# Altium project HYDRA_V4_ACTUATOR.PrjPcb
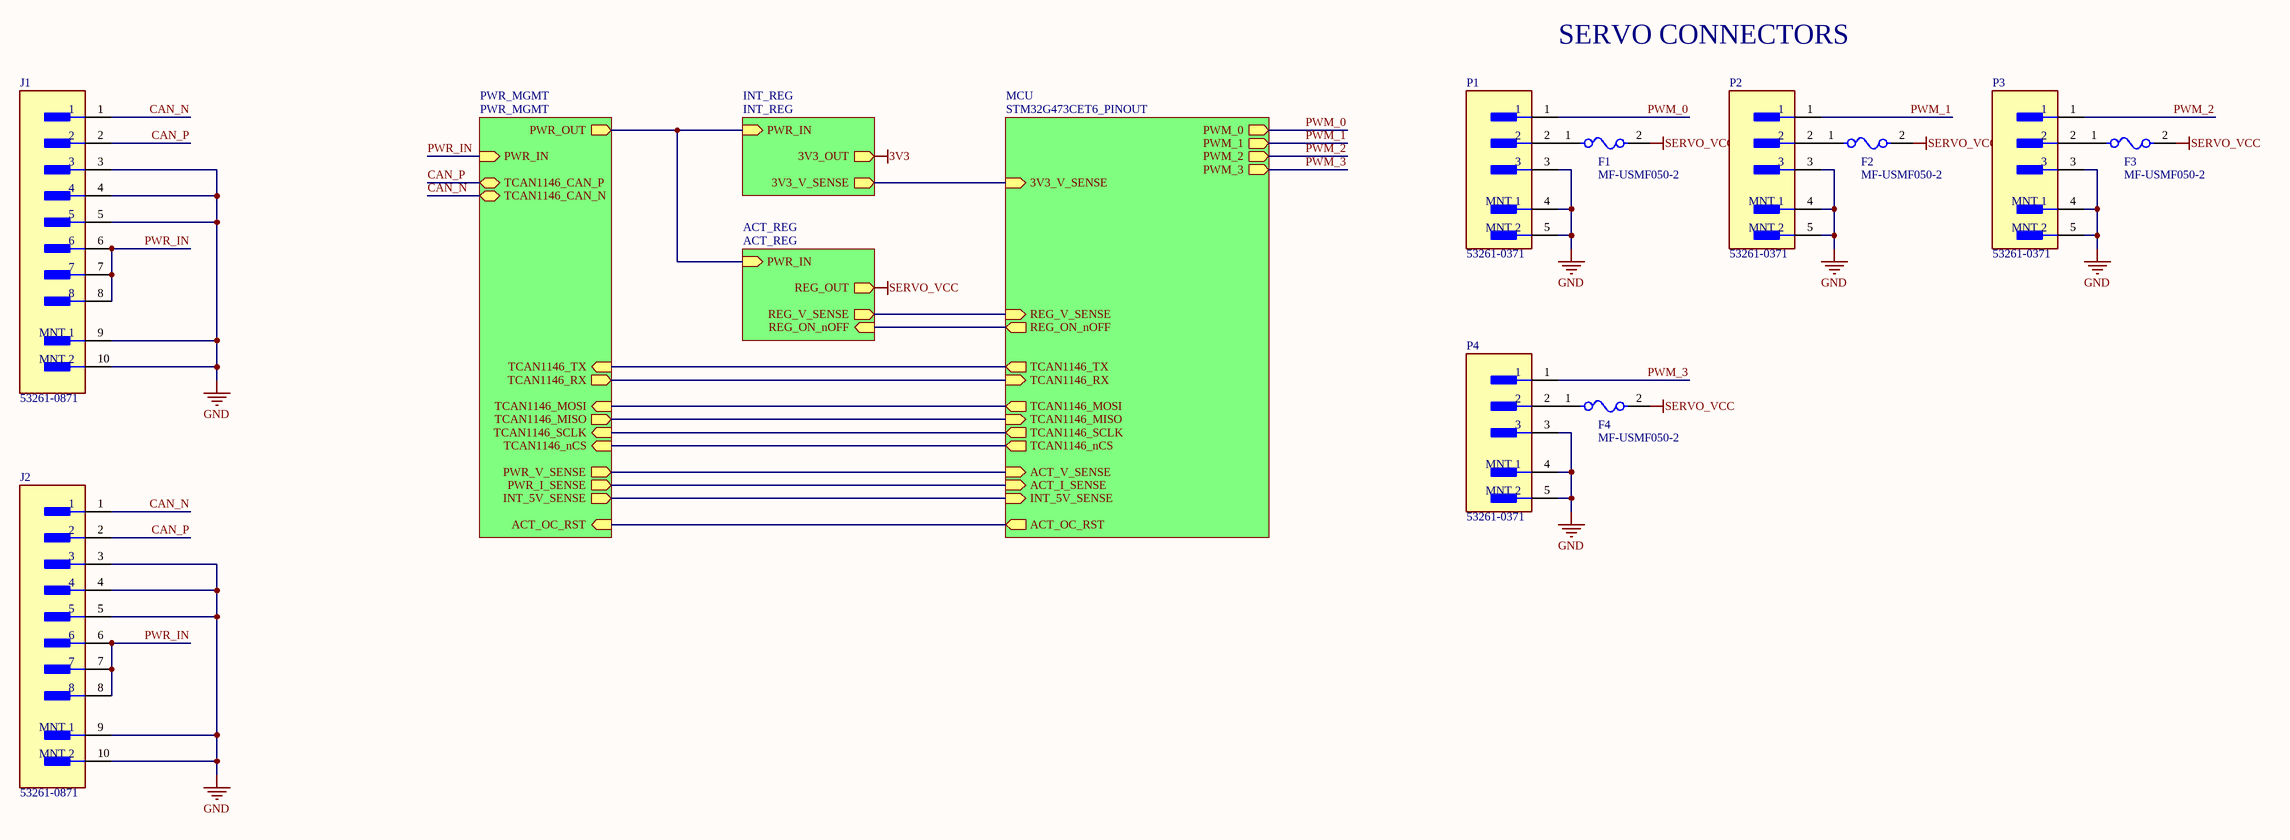
[diagram p0: HYDRA_V4_ACTUATOR.SchDoc]
5 sheets, 99 parts. Net scope: hierarchical (ports join the sheet entries above them; power ports are global).
Board file: HYDRA_V4_ACTUATOR.PcbDoc
Sheets:
  HYDRA_V4_ACTUATOR.SchDoc
    PWR_MGMT = PWR_MGMT.SchDoc
    INT_REG = INT_REG.SchDoc
    MCU = STM32G473CET6_PINOUT.SchDoc
    ACT_REG = ACT_REG.SchDoc

## Sheet HYDRA_V4_ACTUATOR.SchDoc
size C; SheetNumber: 1; SheetTotal: 5

### Parts
F1  MF-USMF050-2  [FP-MF-USMF-MFG]
F2  MF-USMF050-2  [FP-MF-USMF-MFG]
F3  MF-USMF050-2  [FP-MF-USMF-MFG]
F4  MF-USMF050-2  [FP-MF-USMF-MFG]
J1  53261-0871  [FP-532610871-MFG]
J2  53261-0871  [FP-532610871-MFG]
P1  53261-0371  [FP-53261-0371-MFG]
P2  53261-0371  [FP-53261-0371-MFG]
P3  53261-0371  [FP-53261-0371-MFG]
P4  53261-0371  [FP-53261-0371-MFG]

### Sub-sheets
ACT_REG = ACT_REG: PWR_IN (in), REG_OUT (out), REG_V_SENSE (out), REG_ON_nOFF (in)
INT_REG = INT_REG: PWR_IN (in), 3V3_OUT (out), 3V3_V_SENSE (out)
MCU = STM32G473CET6_PINOUT: 3V3_V_SENSE (in), REG_V_SENSE (in), ACT_OC_RST (out), INT_5V_SENSE (in), ACT_I_SENSE (in), ACT_V_SENSE (in), TCAN1146_nCS (out), TCAN1146_SCLK (out), TCAN1146_MISO (in), TCAN1146_MOSI (out), TCAN1146_TX (out), TCAN1146_RX (in), PWM_0 (out), PWM_1 (out), PWM_3 (out), PWM_2 (out), REG_ON_nOFF (out)
PWR_MGMT = PWR_MGMT: PWR_IN (in), PWR_OUT (out), TCAN1146_TX (in), TCAN1146_RX (out), TCAN1146_MOSI (in), TCAN1146_MISO (out), TCAN1146_SCLK (in), TCAN1146_nCS (in), PWR_I_SENSE (out), PWR_V_SENSE (out), INT_5V_SENSE (out), ACT_OC_RST (in), TCAN1146_CAN_P (bidir), TCAN1146_CAN_N (bidir)

### Nets
GND: J1.3 J1.4 J1.5 J1.9(MNT_1) J1.10(MNT_2) J2.3 J2.4 J2.5 J2.9(MNT_1) J2.10(MNT_2) P1.3 P1.4(MNT_1) P1.5(MNT_2) P2.3 P2.4(MNT_1) P2.5(MNT_2) P3.3 P3.4(MNT_1) P3.5(MNT_2) P4.3 P4.4(MNT_1) P4.5(MNT_2)
SERVO_VCC: F1.2 F2.2 F3.2 F4.2 ; sheet ACT_REG/REG_OUT  [project net REG_OUT]
3V3_V_SENSE: sheet INT_REG/3V3_V_SENSE, sheet MCU/3V3_V_SENSE
5V_ON_nOFF: sheet MCU/REG_ON_nOFF, sheet ACT_REG/REG_ON_nOFF
ACT_I_SENSE: sheet PWR_MGMT/PWR_I_SENSE, sheet MCU/ACT_I_SENSE
ACT_OC_RST: sheet PWR_MGMT/ACT_OC_RST, sheet MCU/ACT_OC_RST
ACT_V_SENSE: sheet PWR_MGMT/PWR_V_SENSE, sheet MCU/ACT_V_SENSE
CAN_N: J1.1 J2.1 ; sheet PWR_MGMT/TCAN1146_CAN_N  [project net CAN0_N]
CAN_P: J1.2 J2.2 ; sheet PWR_MGMT/TCAN1146_CAN_P  [project net CAN0_P]
INT_5V_SENSE: sheet PWR_MGMT/INT_5V_SENSE, sheet MCU/INT_5V_SENSE
PWM_0: P1.1 ; sheet MCU/PWM_0
PWM_1: P2.1 ; sheet MCU/PWM_1
PWM_2: P3.1 ; sheet MCU/PWM_2
PWM_3: P4.1 ; sheet MCU/PWM_3
PWR_IN: J1.6 J1.7 J1.8 J2.6 J2.7 J2.8 ; sheet PWR_MGMT/PWR_IN
REG_V_SENSE: sheet MCU/REG_V_SENSE, sheet ACT_REG/REG_V_SENSE
SPI2_MISO: sheet PWR_MGMT/TCAN1146_MISO, sheet MCU/TCAN1146_MISO
SPI2_MOSI: sheet PWR_MGMT/TCAN1146_MOSI, sheet MCU/TCAN1146_MOSI
SPI2_nCS: sheet PWR_MGMT/TCAN1146_nCS, sheet MCU/TCAN1146_nCS
SPI2_SCLK: sheet PWR_MGMT/TCAN1146_SCLK, sheet MCU/TCAN1146_SCLK
TCAN1146_RX: sheet PWR_MGMT/TCAN1146_RX, sheet MCU/TCAN1146_RX
TCAN1146_TX: sheet PWR_MGMT/TCAN1146_TX, sheet MCU/TCAN1146_TX
NetC17_2: sheet PWR_MGMT/PWR_OUT, sheet INT_REG/PWR_IN, sheet ACT_REG/PWR_IN
NetF1_1: F1.1 P1.2
NetF2_1: F2.1 P2.2
NetF3_1: F3.1 P3.2
NetF4_1: F4.1 P4.2

### Notes on the sheet
- SERVO CONNECTORS

### Library data of the parts
F1-F4 = CMP-07400-000020-1: PTC RESET FUSE 13.2V 500MA 1210; Manufacturer: Bourns Inc.; Value: 0.18-0.9Ω; Trip Current: 1A; Current Rating: 40A; Trip Time: 0.1s; Automotive Grade: Grade 3; Hold Current: 0.5A; Package: MF-USMF; Voltage Rating: 13.2V; Device Class L2: PTC Resettable Fuses; Temperature: -40°C to +85°C; Device Class L1: Circuit Protection; Device Class L3: unset; Height: 0.85mm; ComponentLink2Description: Datasheet; Temperature Range Low: -40°C; Ambient Temperature Range Low: -40°C; Category: Fuse; Lead Free: Yes; Temperature Range High: +85°C; Mouser Description: Resettable Fuses - PPTC 0.50A 13.2V 0.18ohm Hold .5A Trip 1A; Manufacturer Part Number: MF-USMF050-2; Resistance: 0.18-0.9Ω; RoHS: TRUE; Ipc Land Pattern Name: CAPC321258X70; Ambient Temperature Range High: +85°C; Automotive: Yes; Digikey Description: PTC RESET FUSE 13.2V 500MA 1210; Octopart: https://octopart.com/mf-usmf050-2-bourns-97645; ComponentLink2URL: https://www.bourns.com/docs/Product-Datasheets/mfusmf.pdf
J1 J2 = CMP-002-00053-1: Board Connector, 8 Contact(s), 1 Row(s), Male, Right Angle, 0.049 inch Pitch, Surface Mount Terminal, Locking, Natural Insulator, Receptacle; RoHS Compliant: Yes; Max Operating Temperature: 85°C; Min Operating Temperature: -40°C; Connector Type: BOARD CONNECTOR; Mounting Technology: Board
P1-P4 = CMP-04776-000071-1: CONN HEADER SMD R/A 3POS 1.25MM; Manufacturer: Molex; Number Of Contacts: 3; Conn Orientation: Right Angle; Current Rating: 1A; Voltage Rating: 125V; Conn Gender: Male; Category: Conn; Automotive: No; Footprint Url: https://www.molex.com/pdm_docs/sd/532610371_sd.pdf; Height: 3.6mm; Number Of Rows: 1; Temperature Range Low: -40°C; Package: 0; Octopart: https://octopart.com/53261-0371-molex-655314; ComponentLink2Description: Datasheet; Lead Free: Yes; Ambient Temperature Range Low: -40°C; Device Class L3: unset; Mouser Description: 1.25mm (.049") Pitch PicoBlade Header, Surface Mount, Right Angle, Lead-free, 3 Circuits; Digikey Description: CONN HEADER SMD R/A 3POS 1.25MM; Device Class L2: Headers and Wire Housings; Contact Material: Tin,Nickel; Manufacturer Part Number: 53261-0371; Ambient Temperature Range High: +105°C; ComponentLink2URL: https://www.molex.com/webdocs/datasheets/pdf/en-us/0532610371_PCB_HEADERS.pdf; Pitch: 1.25mm; Temperature: -40°C to +105°C; RoHS: TRUE; Device Class L1: Connectors; Temperature Range High: +105°C

## Sheet PWR_MGMT.SchDoc
size C; SheetNumber: 4; SheetTotal: 5
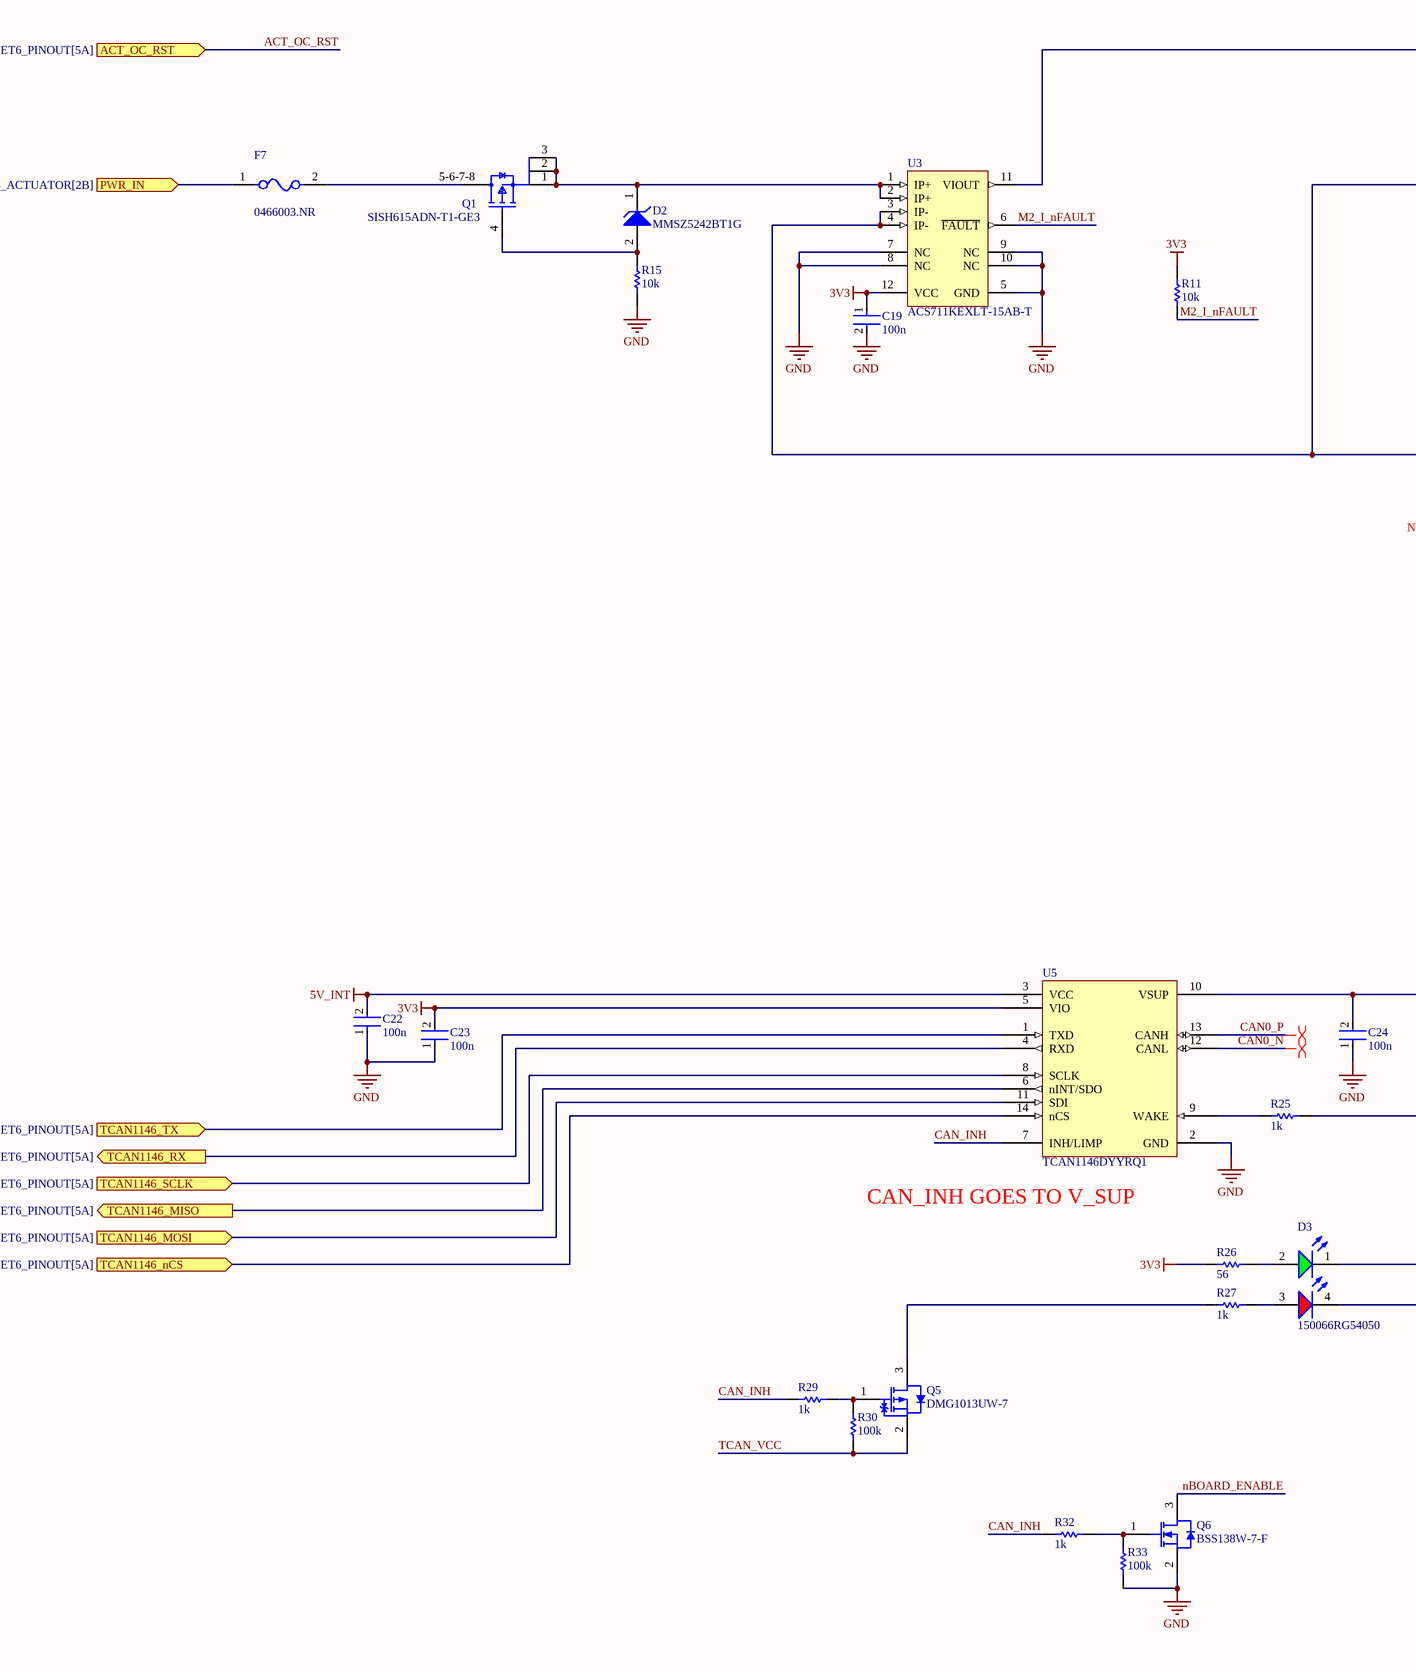
[diagram p1: PWR_MGMT.SchDoc, left]
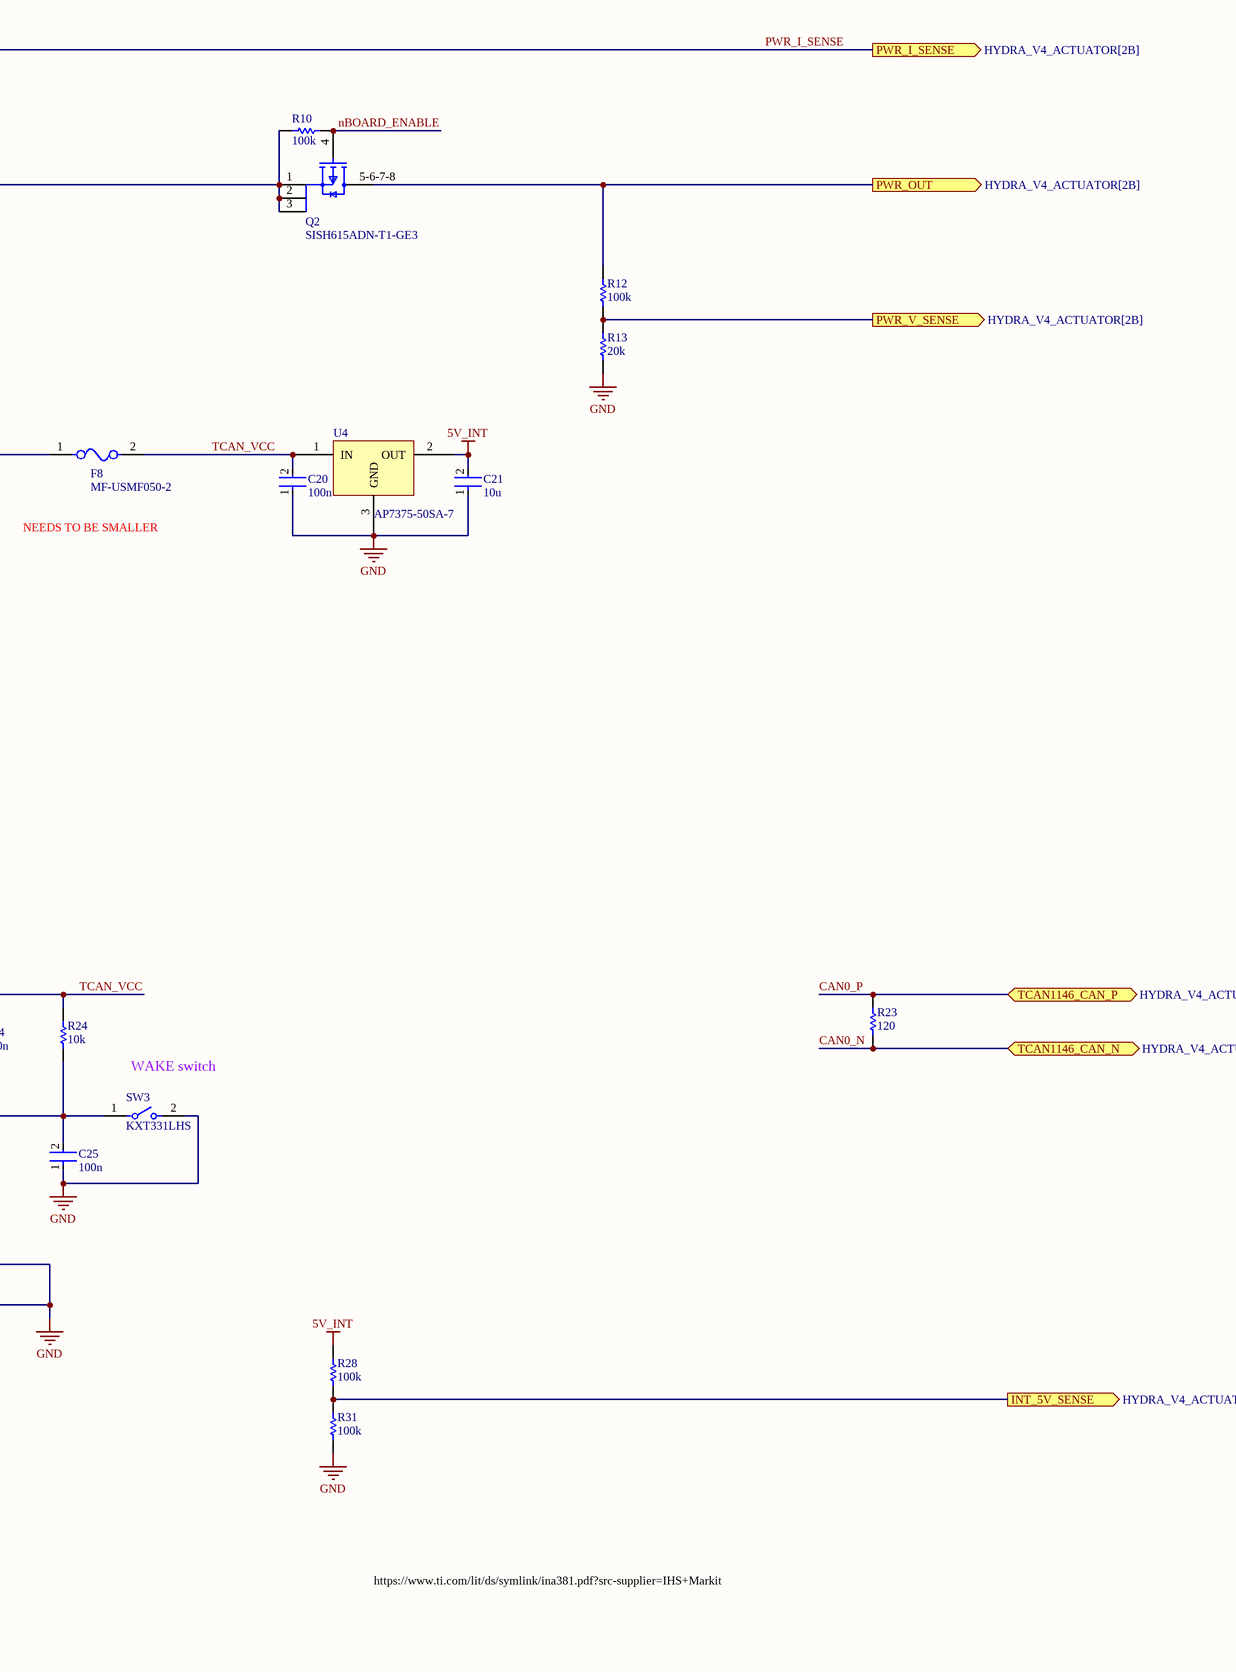
[diagram p2: PWR_MGMT.SchDoc, right]

### Parts
C19  100n  [FP-0402-L_1_0_0_05-W_0_5-IPC_A]
C20  100n  [FP-0402-L_1_0_0_05-W_0_5-IPC_A]
C21  10u  [FP-0402-L_1_0_0_05-W_0_5-IPC_A]
C22  100n  [FP-0402-L_1_0_0_05-W_0_5-IPC_A]
C23  100n  [FP-0402-L_1_0_0_05-W_0_5-IPC_A]
C24  100n  [FP-0402-L_1_0_0_05-W_0_5-IPC_A]
C25  100n  [FP-0402-L_1_0_0_05-W_0_5-IPC_A]
D2  MMSZ5242BT1G  [ONSC-SOD-123-2-425-04_V]
D3  150066RG54050  [WL-SBCD_0606]
F7  0466003.NR  [FP-0466-MFG]
F8  MF-USMF050-2  [FP-MF-USMF-MFG]
Q1  SISH615ADN-T1-GE3  [SISH615ADN-T1-GE3-Footprint-1]
Q2  SISH615ADN-T1-GE3  [SISH615ADN-T1-GE3-Footprint-1]
Q5  DMG1013UW-7  [DIOD-SOT323-3_V]
Q6  BSS138W-7-F  [DIOD-SOT323-3_V]
R10  100k  [R0603B]
R11  10k  [R0603B]
R12  100k  [R0603B]
R13  20k  [R0603B]
R15  10k  [R0603B]
R23  120  [R0603B]
R24  10k  [R0603B]
R25  1k  [R0603B]
R26  56  [R0603B]
R27  1k  [R0603B]
R28  100k  [R0603B]
R29  1k  [R0603B]
R30  100k  [R0603B]
R31  100k  [R0603B]
R32  1k  [R0603B]
R33  100k  [R0603B]
SW3  KXT331LHS  [FP-KXT331LHS-MFG]
U3  ACS711KEXLT-15AB-T  [ALEG-EX-12_V]
U4  AP7375-50SA-7  [AP7375-50SA-7-Footprint-1]
U5  TCAN1146DYYRQ1  [TCAN1146DYYRQ1-Footprint-1]

### Ports
ACT_OC_RST (in, see HYDRA_V4_ACTUATOR[2B], STM32G473CET6_PINOUT[5A]), INT_5V_SENSE (out, see HYDRA_V4_ACTUATOR[2B], STM32G473CET6_PINOUT[5B]), PWR_I_SENSE (out, see HYDRA_V4_ACTUATOR[2B]), PWR_IN (in, see HYDRA_V4_ACTUATOR[2B]), PWR_OUT (out, see HYDRA_V4_ACTUATOR[2B]), PWR_V_SENSE (out, see HYDRA_V4_ACTUATOR[2B]), TCAN1146_CAN_N (bidir, see HYDRA_V4_ACTUATOR[2B]), TCAN1146_CAN_P (bidir, see HYDRA_V4_ACTUATOR[2B]), TCAN1146_MISO (out, see HYDRA_V4_ACTUATOR[2B], STM32G473CET6_PINOUT[5A]), TCAN1146_MOSI (in, see HYDRA_V4_ACTUATOR[2B], STM32G473CET6_PINOUT[5A]), TCAN1146_nCS (in, see HYDRA_V4_ACTUATOR[2B], STM32G473CET6_PINOUT[5A]), TCAN1146_RX (out, see HYDRA_V4_ACTUATOR[2B], STM32G473CET6_PINOUT[5A]), TCAN1146_SCLK (in, see HYDRA_V4_ACTUATOR[2B], STM32G473CET6_PINOUT[5A]), TCAN1146_TX (in, see HYDRA_V4_ACTUATOR[2B], STM32G473CET6_PINOUT[5A])

### Nets
3V3: C19.1 C23.2 R11.2 R26.2 U3.12(VCC) U5.5(VIO)
5V_INT: C21.2 C22.2 R28.2 U4.2(OUT) U5.3(VCC)
GND: C19.2 C20.1 C21.1 C22.1 C23.1 C24.1 C25.1 D3.1(K) D3.4(K) Q6.2(S) R13.1 R15.1 R31.1 R33.1 SW3.2 U3.5(GND) U3.7(NC) U3.8(NC) U3.9(NC) U3.10(NC) U4.3(GND) U5.2(GND)
ACT_V_SENSE: R12.1 R13.2 ; port PWR_V_SENSE
CAN0_N: R23.1 U5.12(CANL) ; port TCAN1146_CAN_N
CAN0_P: R23.2 U5.13(CANH) ; port TCAN1146_CAN_P
CAN_INH: R29.2 R32.2 U5.7(INH/LIMP)
INT_5V_SENSE: R28.1 R31.2 ; port INT_5V_SENSE
M2_I_nFAULT: R11.1 U3.6(~{FAULT})
nBOARD_ENABLE: Q2.4(G) Q6.3(D) R10.2
PWR_I_SENSE: U3.11(VIOUT) ; port PWR_I_SENSE  [project net ACT_I_SENSE]
PWR_IN: F7.1 ; port PWR_IN
SPI2_MISO: U5.6(nINT/SDO) ; port TCAN1146_MISO
SPI2_MOSI: U5.11(SDI) ; port TCAN1146_MOSI
SPI2_nCS: U5.14(nCS) ; port TCAN1146_nCS
SPI2_SCLK: U5.8(SCLK) ; port TCAN1146_SCLK
TCAN1146_RX: U5.4(RXD) ; port TCAN1146_RX
TCAN1146_TX: U5.1(TXD) ; port TCAN1146_TX
TCAN_VCC: C20.2 C24.2 F8.2 Q5.2(S) R24.2 R30.2 U4.1(IN) U5.10(VSUP)
NetC17_2: Q2.5-6-7-8(D) R12.2 ; port PWR_OUT
NetC25_2: C25.2 R24.1 R25.1 SW3.1
NetD2_1: D2.1(K) Q1.1(S) Q1.2(S) Q1.3(S) U3.1(IP+) U3.2(IP+)
NetD2_2: D2.2(A) Q1.4(G) R15.2
NetD3_2: D3.2(A) R26.1
NetD3_3: D3.3(A) R27.1
NetF7_2: F7.2 Q1.5-6-7-8(D)
NetF8_1: F8.1 Q2.1(S) Q2.2(S) Q2.3(S) R10.1 U3.3(IP-) U3.4(IP-)
NetQ5_1: Q5.1(G) R29.1 R30.1
NetQ5_3: Q5.3(D) R27.2
NetQ6_1: Q6.1(G) R32.1 R33.2
NetR25_2: R25.2 U5.9(WAKE)

### Layout directives
differential pair; differential pair class 120DIFF: CAN0_N, CAN0_P

### Notes on the sheet
- NEEDS TO BE SMALLER
- (near SW3) WAKE switch
- (near U5) CAN_INH GOES TO V_SUP
- https://www.ti.com/lit/ds/symlink/ina381.pdf?src-supplier=IHS+Markit

### Library data of the parts
C19-C25 = CMP-001-00058-1: LARGE PADS, 0402 CAP, CHANGE COMMENT TO MATCH REAL P/N; Capacitor Type: Ceramic; Min Operating Temperature: -55°C; Mounting Technology: Surface Mount; Pins: 2; Case/Package: 0402; RoHS Compliant: Yes; Max Operating Temperature: 85°C
D2 = CMP-1060-00565-1: Zener Voltage Regulator, 500 mW, 2-Pin SOD-123, Pb-Free, Tape and Reel; Manufacturer: On Semiconductor; P Max (W): 0.5; VZ Typ (V): 12; PartNumber: MMSZ5242BT1G; PackageReference: SOD-123-2-425-04; ComponentLink3URL: http://www.onsemi.com/pub_link/Collateral/425-04.PDF; Mounting Technology: Surface Mount; ComponentLink2Description: Datasheet; ComponentLink1URL: http://www.onsemi.com/; ComponentLink3Description: Package Specification; PackageDescription: 2-Pin SOD, Body 1.6 x 2.69 mm; PackageVersion: Rev. G, 10/2009; ComponentLink1Description: Manufacturer URL; RoHS: Pb-Free; ComponentLink2URL: http://www.onsemi.com/pub_link/Collateral/MMSZ5221BT1-D.PDF; Packing: Tape and Reel; DatasheetVersion: Rev. 12
D3 = CMP-004-00040-2: Led, Red/Grn, 180Mcd/230Mcd, 624Nm/525Nm Rohs Compliant: Yes; Source: rgled.SchLib; Component Type: Standard; Design Item ID: CMP-004-00034-2; Pins: 4
F7 = CMP-08605-000054-1: FUSE BOARD MNT 3A 32VAC/VDC 1206; Manufacturer: Littelfuse; Fuse Interrupt Ac Current: 50A; Fuse Voltage Drop: 75.99mV; Max Fuse Ac Voltage: 32V; Fuse I2T: 0.576A2Sec; Resistance: 0.019Ω; Fuse Blow Speed: Fast; Value: 0.019Ω; ComponentLink2Description: Datasheet; Fuse Current: 3A; RoHS: TRUE; Mouser Description: Surface Mount Fuses 32V 3A VFA Slimline; Height: 0.66mm; Octopart: https://octopart.com/0466003.nr-littelfuse-565175; Package: 0466; Fuse Interrupt Dc Current: 50A; Manufacturer Part Number: 0466003.NR; Temperature Range Low: -55°C; ComponentLink2URL: https://www.littelfuse.com/~/media/electronics/datasheets/fuses/littelfuse_fuse_466_datasheet.pdf.pdf; Digikey Description: FUSE BOARD MNT 3A 32VAC/VDC 1206; Voltage Rating: 32V; Category: Fuse; Lead Free: Yes; Device Class L2: Fuses; Automotive: No; Max Fuse Dc Voltage: 32V; Temperature Range High: +90°C; Device Class L3: unset; Device Class L1: Circuit Protection; Temperature: -55°C to +90°C
F8 = CMP-07400-000020-1: as F1 on sheet HYDRA_V4_ACTUATOR; Package: MF-USMF; Voltage Rating: 13.2V; Device Class L2: PTC Resettable Fuses; Temperature: -40°C to +85°C; Device Class L1: Circuit Protection; Device Class L3: unset; Height: 0.85mm; ComponentLink2Description: Datasheet; Temperature Range Low: -40°C; Ambient Temperature Range Low: -40°C; Category: Fuse; Lead Free: Yes; Temperature Range High: +85°C; Mouser Description: Resettable Fuses - PPTC 0.50A 13.2V 0.18ohm Hold .5A Trip 1A; Manufacturer Part Number: MF-USMF050-2; Resistance: 0.18-0.9Ω; RoHS: TRUE; Ipc Land Pattern Name: CAPC321258X70; Ambient Temperature Range High: +85°C; Automotive: Yes; Digikey Description: PTC RESET FUSE 13.2V 500MA 1210; Octopart: https://octopart.com/mf-usmf050-2-bourns-97645; ComponentLink2URL: https://www.bourns.com/docs/Product-Datasheets/mfusmf.pdf
Q1 Q2 = CMP-013-00018-2: Trans MOSFET P-CH 20V 22.1A 8-Pin PowerPAK 1212 EP T/R; Source: SISH615ADN-T1-GE3.SchLib; Design Item ID: CMP-013-00036-4; Component Type: Standard; Pins: 5
Q5 = CMP-2000-06170-1: P-Channel Enhancement Mode MOSFET, 310 mW, 20 V, -55 to 150 degC, 3-Pin SOT-323, RoHS, Tape and Reel; Manufacturer: Diodes Inc; Qg Gate Charge: 0.622nC; Drain-Source On Resistance-Max: 750mO; Rated Power Dissipation: 310mW; Drain-to-Source Voltage [Vdss]: 20V; Package Reference: SOT323; Datasheet Version: Rev. 3-2, 09/2013; Package Description: 3-Pin Small Outline Transistor, Body 2 x 1.25 mm, Pitch 0.65 mm; Mounting Technology: SurfaceMount; Manufacturer URL: http://www.diodes.com/; Datasheet URL: http://www.diodes.com/_files/datasheets/ds31861.pdf; Channel Type: P-Channel
Q6 = CMP-2000-05968-1: N-Channel Enhancement Mode Mosfet, 50 V, 200 mA, -55 to 150 degC, 6-Pin SOT-323, RoHS, Tape and Reel; Typical Turn-Off Delay Time: 20ns; Number of Channels: 1Channel; Type: EnhancementModeFieldEffectTransistor; Brand: DiodesIncorporated; Vds - Drain-Source Breakdown Voltage: 75V; Vgs - Gate-Source Voltage: 20V; Rds On - Drain-Source Resistance: 1.4Ohms; Transistor Type: 1N-Channel; Configuration: Single; Unit Weight: 0.000212oz; Pd - Power Dissipation: 200mW; Id - Continuous Drain Current: 200mA; Forward Transconductance - Min: 0.1S; Manufacturer URL: http://www.diodes.com/; Series: BSS138; Package Description: 3-Pin Small Outline Transistor, Body 2 x 1.25 mm, Pitch 0.65 mm; Mounting Technology: SurfaceMount; Product Category: MOSFET; RoHS: True; Maximum Operating Temperature: +150C; Height: 1mm; Length: 2.2mm; Technology: Si; Width: 1.35mm; Datasheet URL: http://www.diodes.com/_files/datasheets/ds30206.pdf; Manufacturer: DiodesIncorporated; Package / Case: SOT-323-3; Typical Turn-On Delay Time: 20ns; Transistor Polarity: N-Channel; Factory Pack Quantity: 3000; Packaging: Reel; Product: MOSFETSmallSignal; Datasheet Version: Rev. 11-2, 09/2013; Package Reference: SOT323; Minimum Operating Temperature: -55C; Mounting Style: SMD/SMT; Channel Mode: Enhancement
R10-R13 R15 R23-R33 = CMP-009-00002-14: Resistor
SW3 = CMP-10040-000029-1: SWITCH TACTILE SPST-NO 0.02A 15V; Operating Force: 240gf; Switch Travel: 0.13mm; Illumination Type: Non-Illuminated; Throw Configuration: SPST; Number of Ports: 1; Current Rating: 5A; Mechanical Life: 500000Cycles; Switch Function: Off-Mom; Connector Type: USB; Actuator Type: Standard; Gender: Receptacle; Number of Contacts: 24; Contact Plating: Gold; Insulation Color: Black; Min Operating Temperature: -40°C; Packaging: Tape and Reel; Flammability Rating: UL94 V-0; Max Operating Temperature: 85°C; Termination: Solder; Mount: Surface Mount
U3 = CMP-1557-00001-1: Hall Effect Linear Current Sensor with Overcurrent Fault Output for <100 V Isolation Applications, 3 to 5.5 V, -15.5 to 15.5 A IP, -40 to 125 degC, 12-Pin QFN (EX), RoHS, Tape and Reel; VCC Max: 5.5 V; IP Max: 15.5 A; VCC Min: 3 V; IP Min: -15.5 A; -3dB Bandwidth: 0.1 MHz; PackageDescription: 12-Pin Quad Flat No-Lead, Body 3 x 3 mm, Height 0.8 mm; ComponentLink1URL: http://www.allegromicro.com/; Packing: Tape and Reel; ComponentLink2URL: http://www.allegromicro.com/~/media/Files/Datasheets/ACS711-Datasheet.ashx?la=en; DatasheetVersion: Rev. 3; PartNumber: ACS711KEXLT-15AB-T; ComponentLink2Description: Datasheet; ComponentLink3URL: http://www.allegromicro.com/~/media/Files/Datasheets/ACS711-Datasheet.ashx?la=en; RoHS: TRUE; ComponentLink1Description: Manufacturer URL; ComponentLink3Description: Package Specification; Temperature Max: 125 degC; Mounting Technology: Surface Mount; Temperature Min: -40 degC
U4 = CMP-019-00041-1: Ldo Cmos Lowcurr SOT23 T&r 3K
U5 = CMP-318-000000-2: Automotive CAN FD transceiver with watchdog, bus diagnostics and partial networking via sele 14-SOT-23-THIN -40 to 150; Component Type: Standard; Design Item ID: CMP-015-00012-2; Pin Count: 14; Source: TCAN1146DYYRQ1.SchLib

## Sheet INT_REG.SchDoc
size A; SheetNumber: 3; SheetTotal: 5
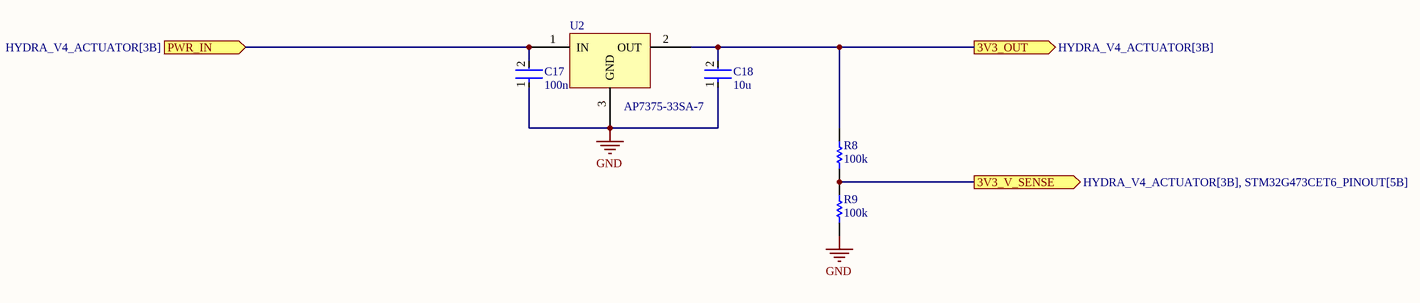
[diagram p3: INT_REG.SchDoc]

### Parts
C17  100n  [FP-0402-L_1_0_0_05-W_0_5-IPC_A]
C18  10u  [FP-0402-L_1_0_0_05-W_0_5-IPC_A]
R8  100k  [R0603B]
R9  100k  [R0603B]
U2  AP7375-33SA-7  [SOT90P285X110-3N]

### Ports
3V3_OUT (out, see HYDRA_V4_ACTUATOR[3B]), 3V3_V_SENSE (out, see HYDRA_V4_ACTUATOR[3B], STM32G473CET6_PINOUT[5B]), PWR_IN (in, see HYDRA_V4_ACTUATOR[3B])

### Nets
3V3: C18.2 R8.2 U2.2(OUT) ; port 3V3_OUT
GND: C17.1 C18.1 R9.1 U2.3(GND)
3V3_V_SENSE: R8.1 R9.2 ; port 3V3_V_SENSE
NetC17_2: C17.2 U2.1(IN) ; port PWR_IN

### Library data of the parts
C17 C18 = CMP-001-00058-1: as C19 on sheet PWR_MGMT; Min Operating Temperature: -55°C; Mounting Technology: Surface Mount; Pins: 2; Case/Package: 0402; RoHS Compliant: Yes; Max Operating Temperature: 85°C
R8 R9 = CMP-009-00002-14: Resistor
U2 = CMP-019-00039-1: LDO Regulator Pos 3.3V 0.3A 3-Pin SOT-23 T/R

## Sheet STM32G473CET6_PINOUT.SchDoc
size C; SheetNumber: 2; SheetTotal: 5
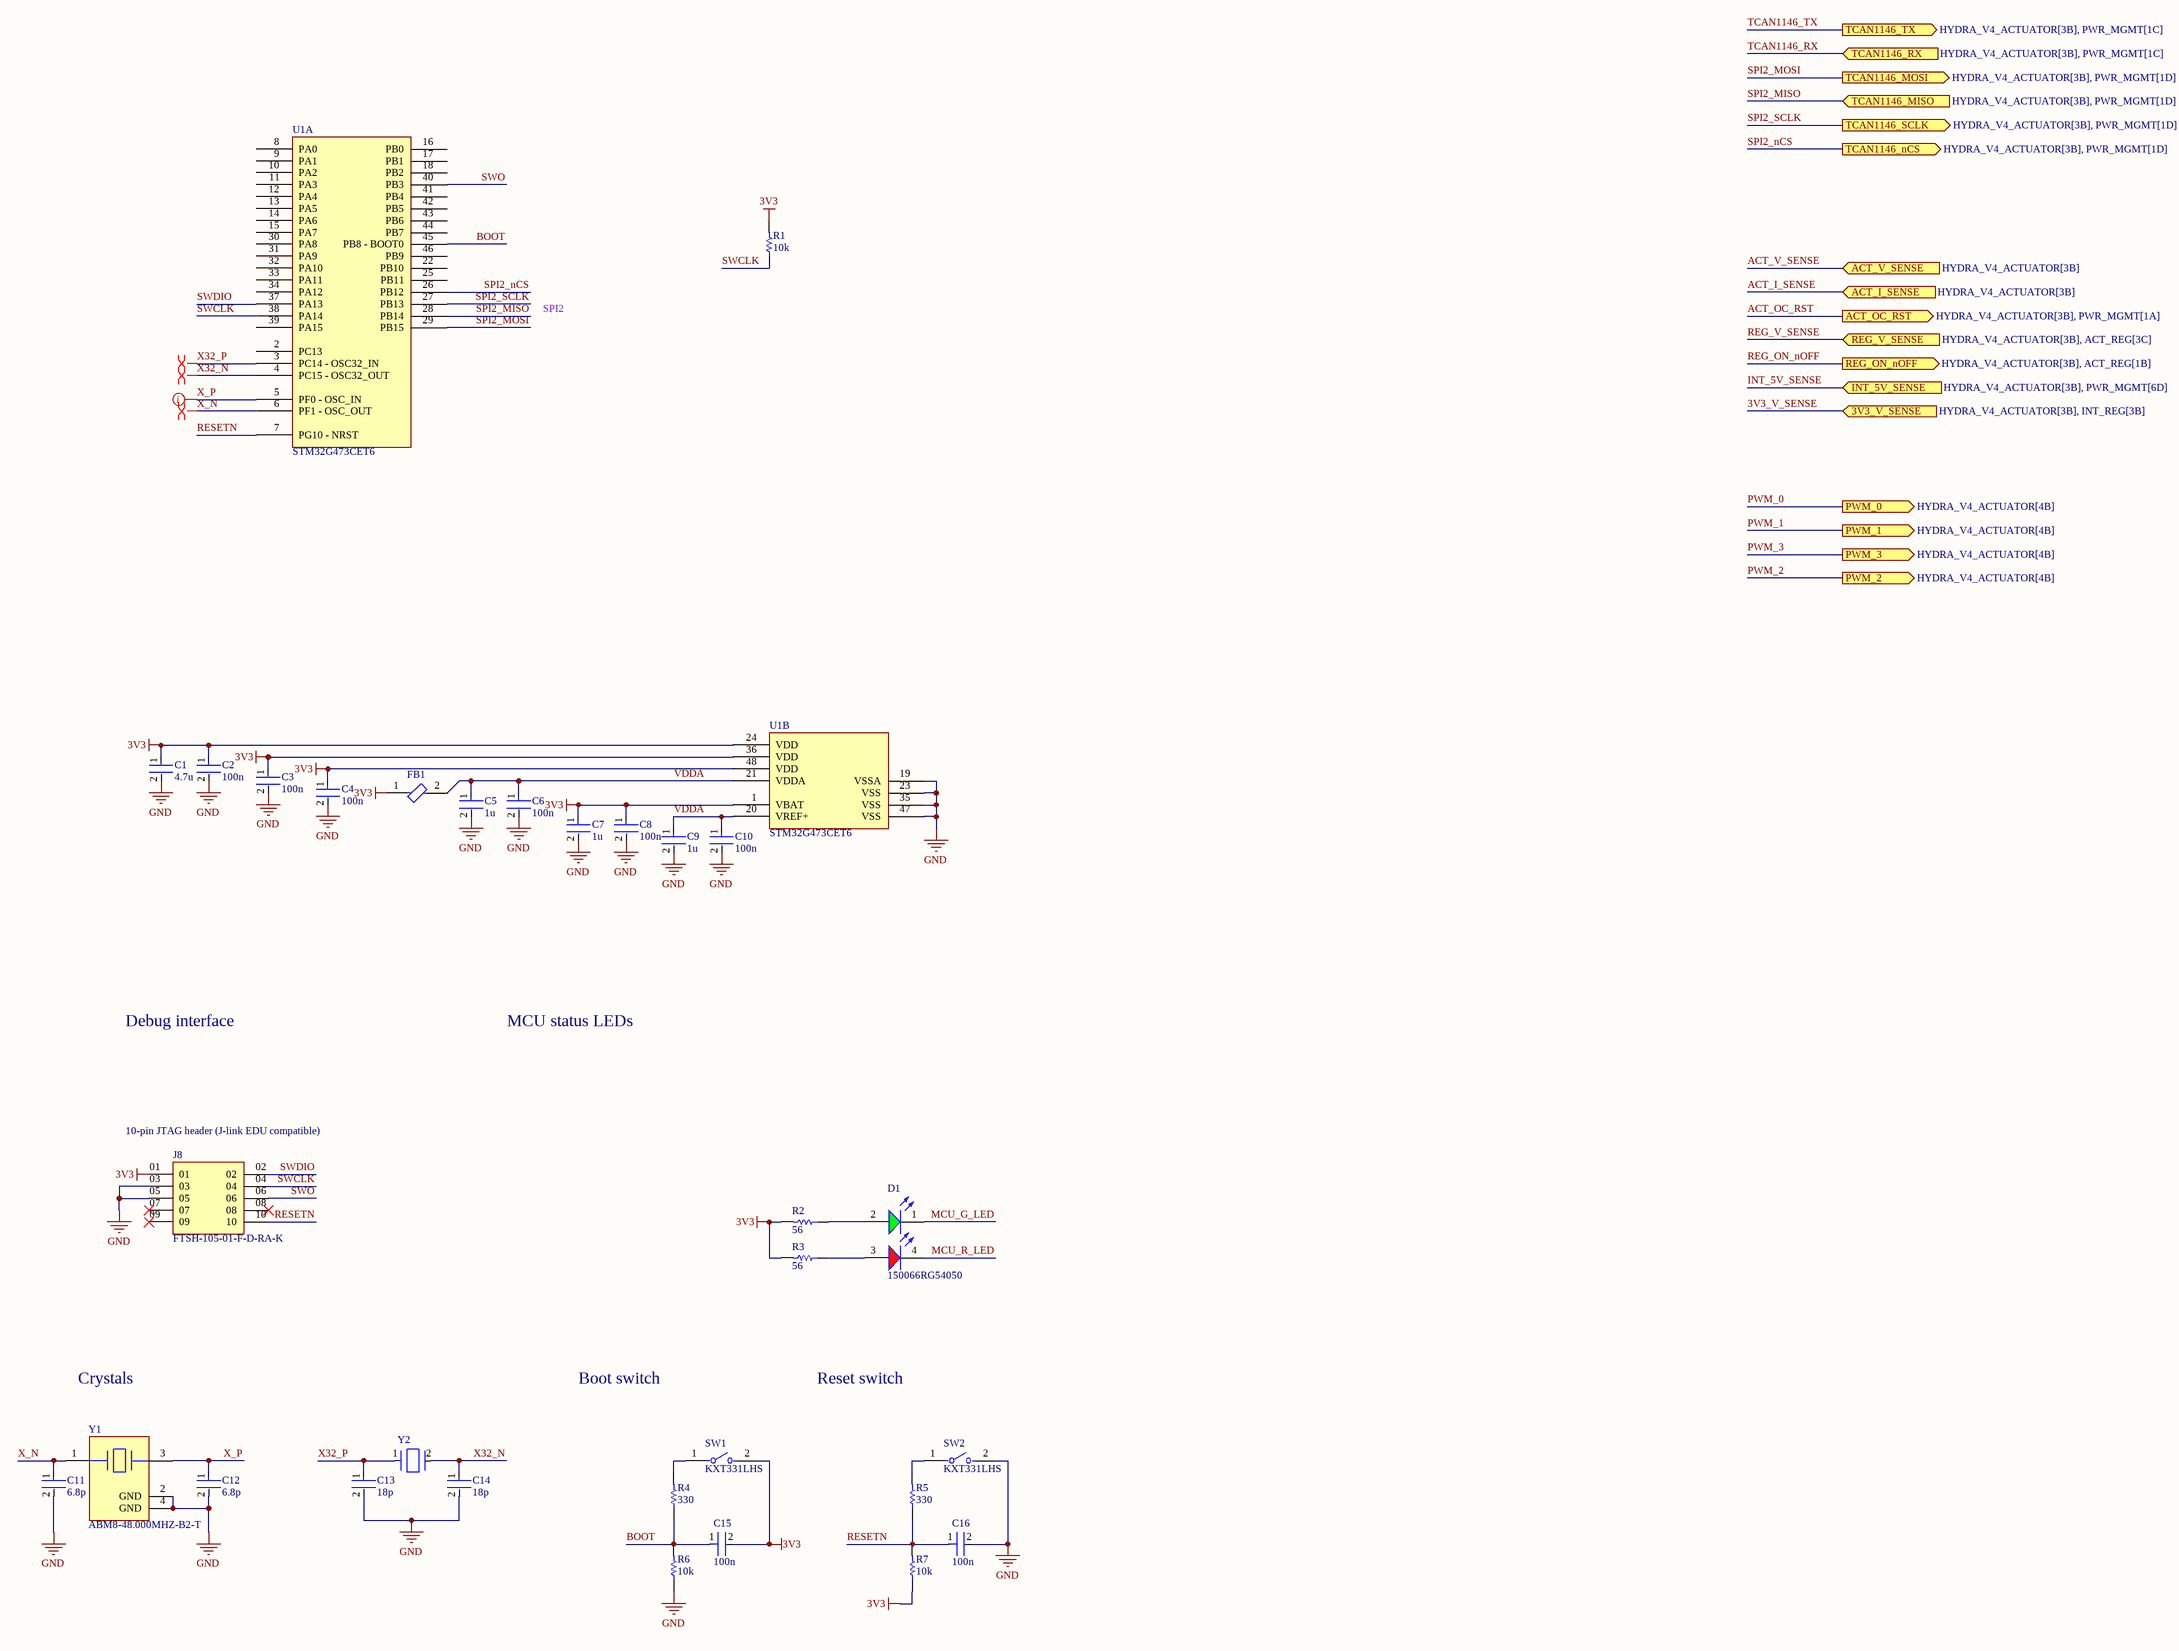
[diagram p4: STM32G473CET6_PINOUT.SchDoc]

### Parts
C1  4.7u  [FP-0402-L_1_0_0_05-W_0_5-IPC_A]
C2  100n  [FP-0402-L_1_0_0_05-W_0_5-IPC_A]
C3  100n  [FP-0402-L_1_0_0_05-W_0_5-IPC_A]
C4  100n  [FP-0402-L_1_0_0_05-W_0_5-IPC_A]
C5  1u  [FP-0402-L_1_0_0_05-W_0_5-IPC_A]
C6  100n  [FP-0402-L_1_0_0_05-W_0_5-IPC_A]
C7  1u  [FP-0402-L_1_0_0_05-W_0_5-IPC_A]
C8  100n  [FP-0402-L_1_0_0_05-W_0_5-IPC_A]
C9  1u  [FP-0402-L_1_0_0_05-W_0_5-IPC_A]
C10  100n  [FP-0402-L_1_0_0_05-W_0_5-IPC_A]
C11  6.8p  [FP-0402-L_1_0_0_05-W_0_5-IPC_A]
C12  6.8p  [FP-0402-L_1_0_0_05-W_0_5-IPC_A]
C13  18p  [FP-0402-L_1_0_0_05-W_0_5-IPC_A]
C14  18p  [FP-0402-L_1_0_0_05-W_0_5-IPC_A]
C15  100n  [FP-0402-L_1_0_0_05-W_0_5-IPC_A]
C16  100n  [FP-0402-L_1_0_0_05-W_0_5-IPC_A]
D1  150066RG54050  [WL-SBCD_0606]
FB1  BLM15PX601SN1D  [FP-BLM15-0_05-MFG]  (value not drawn)
J8  FTSH-105-01-F-D-RA-K  [FTSH-105-01-F-D-RA-K-Footprint-1]
R1  10k  [R0603B]
R2  56  [R0603B]
R3  56  [R0603B]
R4  330  [R0603B]
R5  330  [R0603B]
R6  10k  [R0603B]
R7  10k  [R0603B]
SW1  KXT331LHS  [FP-KXT331LHS-MFG]
SW2  KXT331LHS  [FP-KXT331LHS-MFG]
U1  STM32G473CET6  [TSQFP50P900X900X160-48N]  (parts A,B of 2)
Y1  ABM8-48.000MHZ-B2-T  [FP-ABM8-MFG]
Y2  ECS-.327-12.5-1210-TR  [FP-ECX-1210-MFG]  (value not drawn)

### Ports
3V3_V_SENSE (in, see HYDRA_V4_ACTUATOR[3B], INT_REG[3B]), ACT_I_SENSE (in, see HYDRA_V4_ACTUATOR[3B]), ACT_OC_RST (out, see HYDRA_V4_ACTUATOR[3B], PWR_MGMT[1A]), ACT_V_SENSE (in, see HYDRA_V4_ACTUATOR[3B]), INT_5V_SENSE (in, see HYDRA_V4_ACTUATOR[3B], PWR_MGMT[6D]), PWM_0 (out, see HYDRA_V4_ACTUATOR[4B]), PWM_1 (out, see HYDRA_V4_ACTUATOR[4B]), PWM_2 (out, see HYDRA_V4_ACTUATOR[4B]), PWM_3 (out, see HYDRA_V4_ACTUATOR[4B]), REG_ON_nOFF (out, see HYDRA_V4_ACTUATOR[3B], ACT_REG[1B]), REG_V_SENSE (in, see HYDRA_V4_ACTUATOR[3B], ACT_REG[3C]), TCAN1146_MISO (in, see HYDRA_V4_ACTUATOR[3B], PWR_MGMT[1D]), TCAN1146_MOSI (out, see HYDRA_V4_ACTUATOR[3B], PWR_MGMT[1D]), TCAN1146_nCS (out, see HYDRA_V4_ACTUATOR[3B], PWR_MGMT[1D]), TCAN1146_RX (in, see HYDRA_V4_ACTUATOR[3B], PWR_MGMT[1C]), TCAN1146_SCLK (out, see HYDRA_V4_ACTUATOR[3B], PWR_MGMT[1D]), TCAN1146_TX (out, see HYDRA_V4_ACTUATOR[3B], PWR_MGMT[1C])

### Nets
3V3: C1.1 C2.1 C3.1 C4.1 C7.1 C8.1 C15.2 FB1.1 J8.01 R1.2 R2.2 R3.2 R7.1 SW1.2 U1.1(VBAT) U1.24(VDD) U1.36(VDD) U1.48(VDD)
GND: C1.2 C2.2 C3.2 C4.2 C5.2 C6.2 C7.2 C8.2 C9.2 C10.2 C11.2 C12.2 C13.2 C14.2 C16.2 J8.03 J8.05 R6.1 SW2.2 U1.19(VSSA) U1.23(VSS) U1.35(VSS) U1.47(VSS) Y1.2(GND) Y1.4(GND)
BOOT: C15.1 R4.1 R6.2 U1.45(PB8_-_BOOT0)
MCU_G_LED: D1.1(K)
MCU_R_LED: D1.4(K)
RESETN: C16.1 J8.10 R5.1 R7.2 U1.7(PG10_-_NRST)
SPI2_MISO: U1.28(PB14) ; port TCAN1146_MISO
SPI2_MOSI: U1.29(PB15) ; port TCAN1146_MOSI
SPI2_nCS: U1.26(PB12) ; port TCAN1146_nCS
SPI2_SCLK: U1.27(PB13) ; port TCAN1146_SCLK
SWCLK: J8.04 R1.1 U1.38(PA14)
SWDIO: J8.02 U1.37(PA13)
SWO: J8.06 U1.40(PB3)
VDDA: C5.1 C6.1 C9.1 C10.1 FB1.2 U1.20(VREF+) U1.21(VDDA)
X32_N: C14.1 U1.4(PC15_-_OSC32_OUT) Y2.2(Out/In)
X32_P: C13.1 U1.3(PC14_-_OSC32_IN) Y2.1(In/Out)
X_N: C11.1 U1.6(PF1_-_OSC_OUT) Y1.1
X_P: C12.1 U1.5(PF0_-_OSC_IN) Y1.3
NetD1_2: D1.2(A) R2.1
NetD1_3: D1.3(A) R3.1
NetR4_2: R4.2 SW1.1
NetR5_2: R5.2 SW2.1

Not connected (* = marked no-connect by the designer): J8 07* 08* 09*; U1 2(PC13) 8(PA0) 9(PA1) 10(PA2) 11(PA3) 12(PA4) 13(PA5) 14(PA6) 15(PA7) 16(PB0) 17(PB1) 18(PB2) 22(PB10) 25(PB11) 30(PA8) 31(PA9) 32(PA10) 33(PA11) 34(PA12) 39(PA15) 41(PB4) 42(PB5) 43(PB6) 44(PB7) 46(PB9)

### Layout directives
differential pair: X32_N, X32_P, X_N, X_P

### Notes on the sheet
- SPI2
- Debug interface
- MCU status LEDs
- (near J8) 10-pin JTAG header (J-link EDU compatible)
- Crystals
- Boot switch
- Reset switch

### Library data of the parts
C1-C16 = CMP-001-00058-1: as C19 on sheet PWR_MGMT; Min Operating Temperature: -55°C; Mounting Technology: Surface Mount; Pins: 2; Case/Package: 0402; RoHS Compliant: Yes; Max Operating Temperature: 85°C
D1 = CMP-004-00040-2: as D3 on sheet PWR_MGMT; Source: rgled.SchLib; Component Type: Standard; Design Item ID: CMP-004-00034-2; Pins: 4
FB1 = CMP-0686-00252-4: Chip Ferrite Bead, 0402, 600Ω @ 100MHz, 0.23Ω, 25%, 900mA; Number of Circuits: 1; Impedance: 600R; DC Resistance (DCR): 230mR; Material: Steel; Length: 1mm; Package Quantity: 10000; Height: 0.5mm; Width: 0.5mm; Max DC Current: 900mA; Number of Lines: 1; Termination: SMD/SMT; Packaging: Tape and Reel; Lead Free: Lead Free; Min Operating Temperature: -55°C; Max Operating Temperature: 125°C; Max Current Rating: 900mA; Case Code (Imperial): 0402; Number of Pins: 2; Current Rating: 900mA; Test Frequency: 100MHz; Case/Package: 0402; Tolerance: 25%; Case Code (Metric): 1005
J8 = CMP-002-00041-5: Board Connector, 10 Contact(s), 2 Row(s), Male, Right Angle, 0.05 inch Pitch, Surface Mount Terminal, Locking, Black Insulator; Connector Type: BOARD CONNECTOR; Mounting Technology: Board; RoHS Compliant: Yes
R1-R7 = CMP-009-00002-14: Resistor
SW1 SW2 = CMP-10040-000029-1: as SW3 on sheet PWR_MGMT; Contact Plating: Gold; Insulation Color: Black; Min Operating Temperature: -40°C; Packaging: Tape and Reel; Flammability Rating: UL94 V-0; Max Operating Temperature: 85°C; Termination: Solder; Mount: Surface Mount
U1 = CMP-020-00018-2: RISC Microcontroller, 32-Bit, 170MHz; RoHS Compliant: Yes
Y1 = CMP-27762-011708-1: Crystal 48MHz ±20ppm 18pF SMD-4 3.2mm x 2.5mm; Series Resistance: 35R; Frequency Stability: 50ppm; Package Quantity: 1000; Packaging: Tape and Reel; Mount: Surface Mount; Length: 3.2mm; Load Capacitance: 18pF; Max Operating Temperature: 70°C; Operating Frequency: 48 MHz; RoHS Compliant: Yes; Series: ABM8; Frequency Tolerance: 20ppm; Lead Free: Lead Free; Min Operating Temperature: -20°C; Case/Package: CSMD; Number of Pins: 4; Height: 0.031inch; ESR (Equivalent Series Resistance): 35R; Frequency: 48MHz; Radiation Hardening: No; Width: 0.098inch; Tolerance: 20ppm; Termination: SMD/SMT; Depth: 2.5mm; Resistor Type: Ceramic; REACH SVHC: No SVHC
Y2 = CMP-40224-000006-1: CRYSTAL 32.7680KHZ 12.5PF SMD; Manufacturer: ECS International; Frequency: 32.768kHz; Esr: 90kΩ; Tolerance: 20ppm; Device Class L1: Passive Components; Load Capacitance: 12.5pF; Temperature: -40°C to +85°C; ComponentLink2URL: https://ecsxtal.com/store/pdf/ECX-1210.pdf; Series: ECX-1210; Octopart: https://octopart.com/ecs-.327-12.5-1210-tr-ecs+international-81221340; ComponentLink2Description: Datasheet; Temperature Range Low: -40°C; Digikey Description: CRYSTAL 32.7680KHZ 12.5PF SMD; Lead Free: Yes; RoHS: TRUE; Device Class L3: Crystals; Automotive: No; Category: Crys; Height: 0.5mm; Manufacturer Part Number: ECS-.327-12.5-1210-TR; Temperature Range High: +85°C; Device Class L2: Crystals / Oscillators; Package: ECX-1210

## Sheet ACT_REG.SchDoc
size A; SheetNumber: 5; SheetTotal: 5
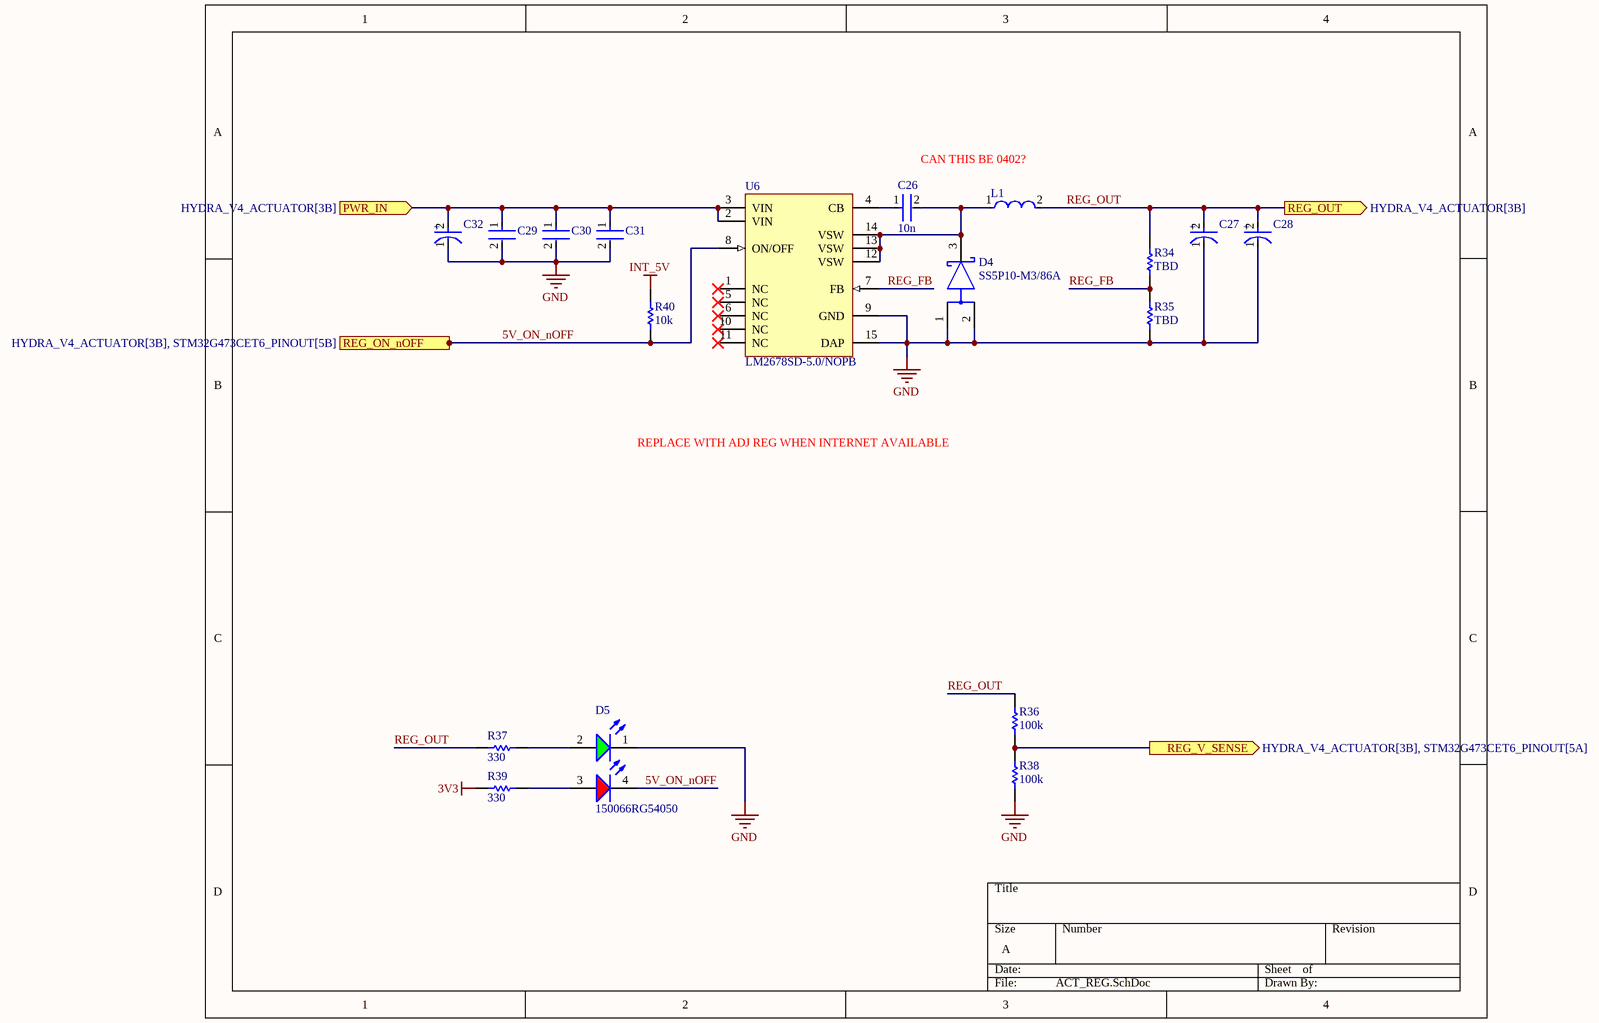
[diagram p5: ACT_REG.SchDoc]

### Parts
C26  10n  [FP-0402-L_1_0_0_05-W_0_5-IPC_A]
C27  10TPC68M  [FP-POSCAP-D2-MFG]  (value not drawn)
C28  10TPC68M  [FP-POSCAP-D2-MFG]  (value not drawn)
C29  C2012X5R1V156M125AC  [FP-C2012-125-0_2-MFG]  (value not drawn)
C30  C2012X5R1V156M125AC  [FP-C2012-125-0_2-MFG]  (value not drawn)
C31  C2012X5R1V156M125AC  [FP-C2012-125-0_2-MFG]  (value not drawn)
C32  10TPC68M  [FP-POSCAP-D2-MFG]  (value not drawn)
D4  SS5P10-M3/86A  [FP-95570-MFG]
D5  150066RG54050  [WL-SBCD_0606]
L1  IHLP4040DZER220M11  [FP-IHLP-4040DZ-FP_3_124x3-MFG]  (value not drawn)
R34  TBD  [R0603B]
R35  TBD  [R0603B]
R36  100k  [R0603B]
R37  330  [R0603B]
R38  100k  [R0603B]
R39  330  [R0603B]
R40  10k  [R0603B]
U6  LM2678SD-5.0/NOPB  [NHM0014A_V]

### Ports
PWR_IN (in, see HYDRA_V4_ACTUATOR[3B]), REG_ON_nOFF (in, see HYDRA_V4_ACTUATOR[3B], STM32G473CET6_PINOUT[5B]), REG_OUT (out, see HYDRA_V4_ACTUATOR[3B]), REG_V_SENSE (out, see HYDRA_V4_ACTUATOR[3B], STM32G473CET6_PINOUT[5A])

### Nets
3V3: R39.2
GND: C27.1(C) C28.1(C) C29.2 C30.2 C31.2 C32.1(C) D4.1(A) D4.2(A) D5.1(K) R35.1 R38.1 U6.9(GND) U6.15(DAP)
INT_5V: R40.2
REG_OUT: C27.2(A) C28.2(A) L1.2 R34.2 R36.2 R37.2 ; port REG_OUT
5V_ON_nOFF: D5.4(K) R40.1 U6.8(ON/OFF) ; port REG_ON_nOFF
REG_FB: R34.1 R35.2 U6.7(FB)
REG_V_SENSE: R36.1 R38.2 ; port REG_V_SENSE
NetC17_2: C29.1 C30.1 C31.1 C32.2(A) U6.2(VIN) U6.3(VIN) ; port PWR_IN
NetC26_1: C26.1 U6.4(CB)
NetC26_2: C26.2 D4.3(C) L1.1 U6.12(VSW) U6.13(VSW) U6.14(VSW)
NetD5_2: D5.2(A) R37.1
NetD5_3: D5.3(A) R39.1

Not connected (* = marked no-connect by the designer): U6 1(NC)* 5(NC)* 6(NC)* 10(NC)* 11(NC)*

### Notes on the sheet
- CAN THIS BE 0402?
- REPLACE WITH ADJ REG WHEN INTERNET AVAILABLE
- (in symbol CMP-05428-000598-1) +

### Library data of the parts
C26 = CMP-001-00058-1: as C19 on sheet PWR_MGMT; Min Operating Temperature: -55°C; Mounting Technology: Surface Mount; Pins: 2; Case/Package: 0402; RoHS Compliant: Yes; Max Operating Temperature: 85°C
C27 C28 C32 = CMP-05428-000598-1: Molded Tantalum Polymer Capacitor 68uF 20% 10V life 2000Hours SMD 2917; Dissipation Factor: 10%; ESR (Equivalent Series Resistance): 45mR; Leakage Current: 68uA; Polarity: Polar; Ripple Current: 1.7A; Material: Polymer; Voltage Rating: 10V; Voltage: 10V; Features: General Purpose; Width: 4.3mm; Packaging: Tape and Reel; Termination: SMD/SMT; Radiation Hardening: No; Construction: Flat; Height: 1.9mm; Height - Seated (Max): 0.079inch; Case Code (Metric): 7343; Length: 7.3mm; Case/Package: 2917; Depth: 4.3mm; Mount: Surface Mount; Capacitance: 68uF; Case Code (Imperial): 2917; Package Quantity: 3000; Tolerance: 20%; REACH SVHC: No SVHC; Series: POSCAP™ TPC; Lead Free: Lead Free; Min Operating Temperature: -55°C; RoHS Compliant: Yes; Voltage Rating (DC): 10V; Number of Pins: 2; Max Operating Temperature: 105°C
C29-C31 = CMP-08246-005496-1: Multilayer Ceramic Capacitors 15μF ±20% 35V X5R SMD 0805; Capacitance: 15uF; Mount: Surface Mount; Dielectric Material: Ceramic; Package Quantity: 2000; Termination: SMD/SMT; Height: 1.25mm; Min Operating Temperature: -55°C; Tolerance: 20%; Width: 0.049inch; Length: 0.079inch; Lead Free: Lead Free; Max Operating Temperature: 85°C; Voltage Rating: 35V; Case/Package: 0805; Packaging: Tape and Reel; RoHS Compliant: Yes; Case Code (Metric): 2012; Voltage Rating (DC): 35V; Dielectric: X5R; Thickness: 0.057inch; Case Code (Imperial): 0805; Resistor Type: Ceramic; Series: C
D4 = CMP-02539-000057-1: DIODE SCHOTTKY 100V 5A TO277A; Max Forward Surge Current (Ifsm): 150A; Element Configuration: Common Cathode; Max Reverse Leakage Current: 15uA; Forward Voltage: 880mV; Case/Package: TO-277A; Number of Pins: 3; Max Reverse Voltage (DC): 100V; Height: 0.031inch; Peak Non-Repetitive Surge Current: 150A; Series: eSMP®; Radiation Hardening: No; Length: 0.242inch; Max Repetitive Reverse Voltage (Vrrm): 100V; Forward Current: 5A; Width: 0.171inch; Min Operating Temperature: -55°C; Max Surge Current: 150A; Lead Free: Lead Free; RoHS Compliant: Yes; Average Rectified Current: 5A; Max Operating Temperature: 150°C; Max Reverse Current: 15uA; Package Quantity: 1500; Packaging: Tape and Reel; Mount: Surface Mount
D5 = CMP-004-00040-2: as D3 on sheet PWR_MGMT; Source: rgled.SchLib; Component Type: Standard; Design Item ID: CMP-004-00034-2; Pins: 4
L1 = CMP-02424-000785-1: Commercial Inductors, Low DCR Series 22uH 5A 66mΩ 20%; Shielding: Shielded; Max DC Current: 4.5A; Test Frequency: 100kHz; DC Resistance (DCR): 66mR; Self Resonant Frequency: 1MHz; Core Material: Metal; Series: IHLP-4040DZ-11; Min Operating Temperature: -55°C; Rated Current-Max: 5A; Current Rating: 5A; Military Standard: Not; Depth: 10.3mm; Height - Seated (Max): 0.157inch; Contact Plating: Tin; Termination: SMD/SMT; Length: 0.43inch; Package Quantity: 1; Width: 0.405inch; Inductance Tolerance: 20%; Tolerance: 20%; Height: 4mm; RMS Current (Irms): 5A; Saturation Current: 4.5A; Inductance: 22uH; Mount: Surface Mount; Max Operating Temperature: 125°C; Case/Package: 4040; Packaging: Tape and Reel; Radiation Hardening: No; RoHS Compliant: Yes; Lead Free: Lead Free
R34-R40 = CMP-009-00002-14: Resistor
U6 = CMP-0069-01082-3: SIMPLE SWITCHER® High Efficiency 5A Step-Down Voltage Regulator, 14-pin LLP, Pb-Free; Manufacturer: Texas Instruments; PackageTopMarking: NS*UZXYTT*S0003DB; PowerWise: N; ComponentLink1Description: Datasheet URL; PackageReference: NHM0014A; PackageDescription: LLP, Plastic, Dual, 6 x 5 x 1mm Body, 14 Lead, 0.8mm Pitch, No Pullback; ComponentLink1URL: http://www.ti.com/general/docs/lit/getliterature.tsp?genericPartNumber=LM2678&fileType=pdf; RoHS: Y; PinCount: 14; CompType: Switcher

## Nets that join several sheets
3V3: PWR_MGMT (6 pins), INT_REG (C18.2 R8.2 U2.2), STM32G473CET6_PINOUT (18 pins), ACT_REG (R39.2)
GND: HYDRA_V4_ACTUATOR (22 pins), PWR_MGMT (22 pins), INT_REG (C17.1 C18.1 R9.1 U2.3), STM32G473CET6_PINOUT (25 pins), ACT_REG (13 pins)
REG_OUT: HYDRA_V4_ACTUATOR (F1.2 F2.2 F3.2 F4.2), ACT_REG (6 pins)
CAN0_N: HYDRA_V4_ACTUATOR (J1.1 J2.1), PWR_MGMT (R23.1 U5.12)
CAN0_P: HYDRA_V4_ACTUATOR (J1.2 J2.2), PWR_MGMT (R23.2 U5.13)
NetC17_2: PWR_MGMT (Q2.5-6-7-8 R12.2), INT_REG (C17.2 U2.1), ACT_REG (6 pins)
PWR_IN: HYDRA_V4_ACTUATOR (6 pins), PWR_MGMT (F7.1)
SPI2_MISO: PWR_MGMT (U5.6), STM32G473CET6_PINOUT (U1.28)
SPI2_MOSI: PWR_MGMT (U5.11), STM32G473CET6_PINOUT (U1.29)
SPI2_nCS: PWR_MGMT (U5.14), STM32G473CET6_PINOUT (U1.26)
SPI2_SCLK: PWR_MGMT (U5.8), STM32G473CET6_PINOUT (U1.27)